# EAGLE design CANBed_case (EAGLE 6.4)
DESCRIPTION: microOBD 200 OBD-II Module; HW_REV: 1.4; PCB_REV: C; PCB_SPEC1: Layer Count: 4; PCB_SPEC2: Size: 1.3" x 0.59"; PCB_SPEC3: Finish Thickness: 0.049" - 0.052"; PCB_SPEC4: Copper Weight: 1oz; TITLE: STM1120

## Sheet 1 of 2
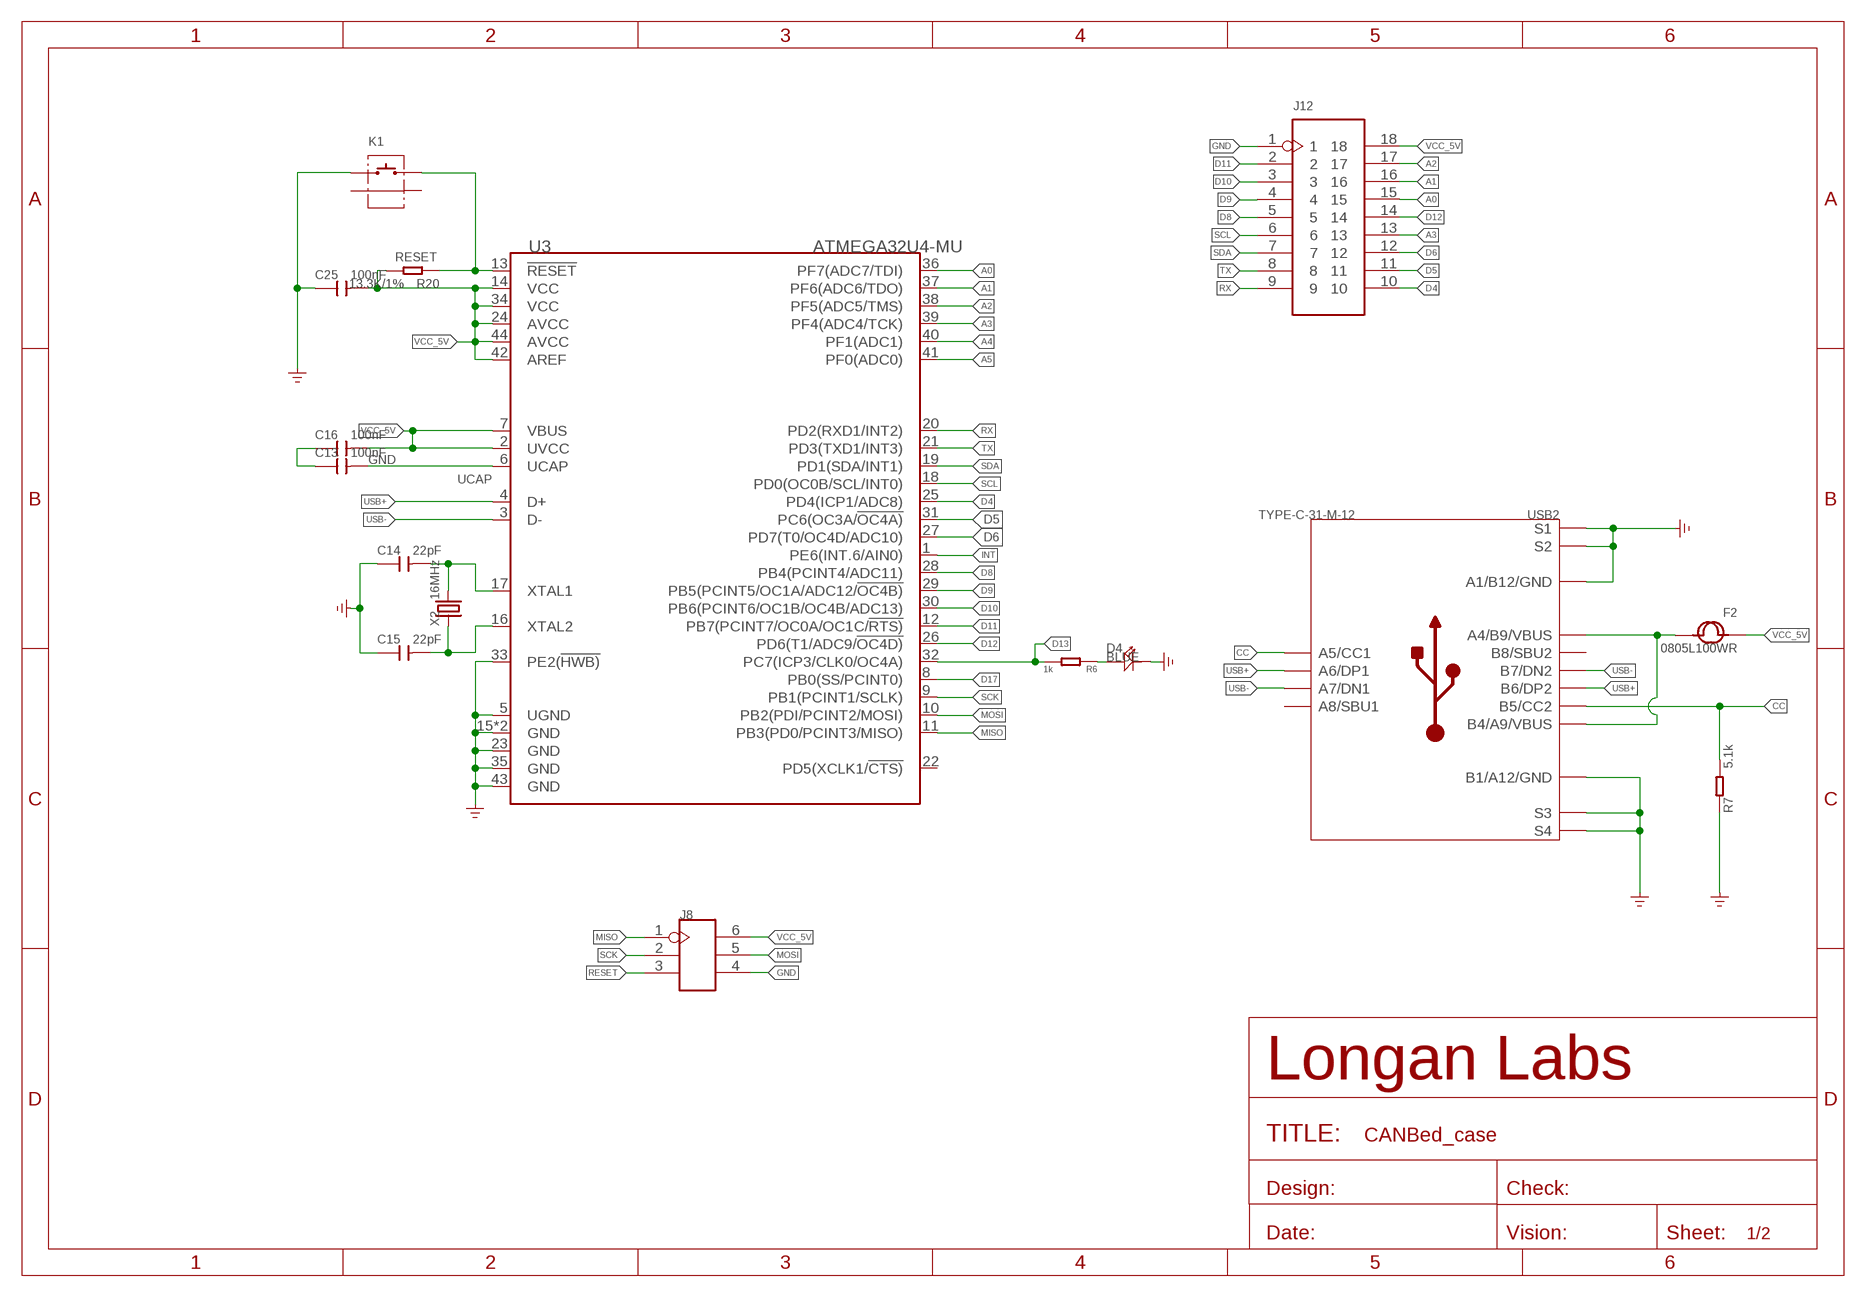
[diagram p0: schematic, sheet 1, part 1 of 2]
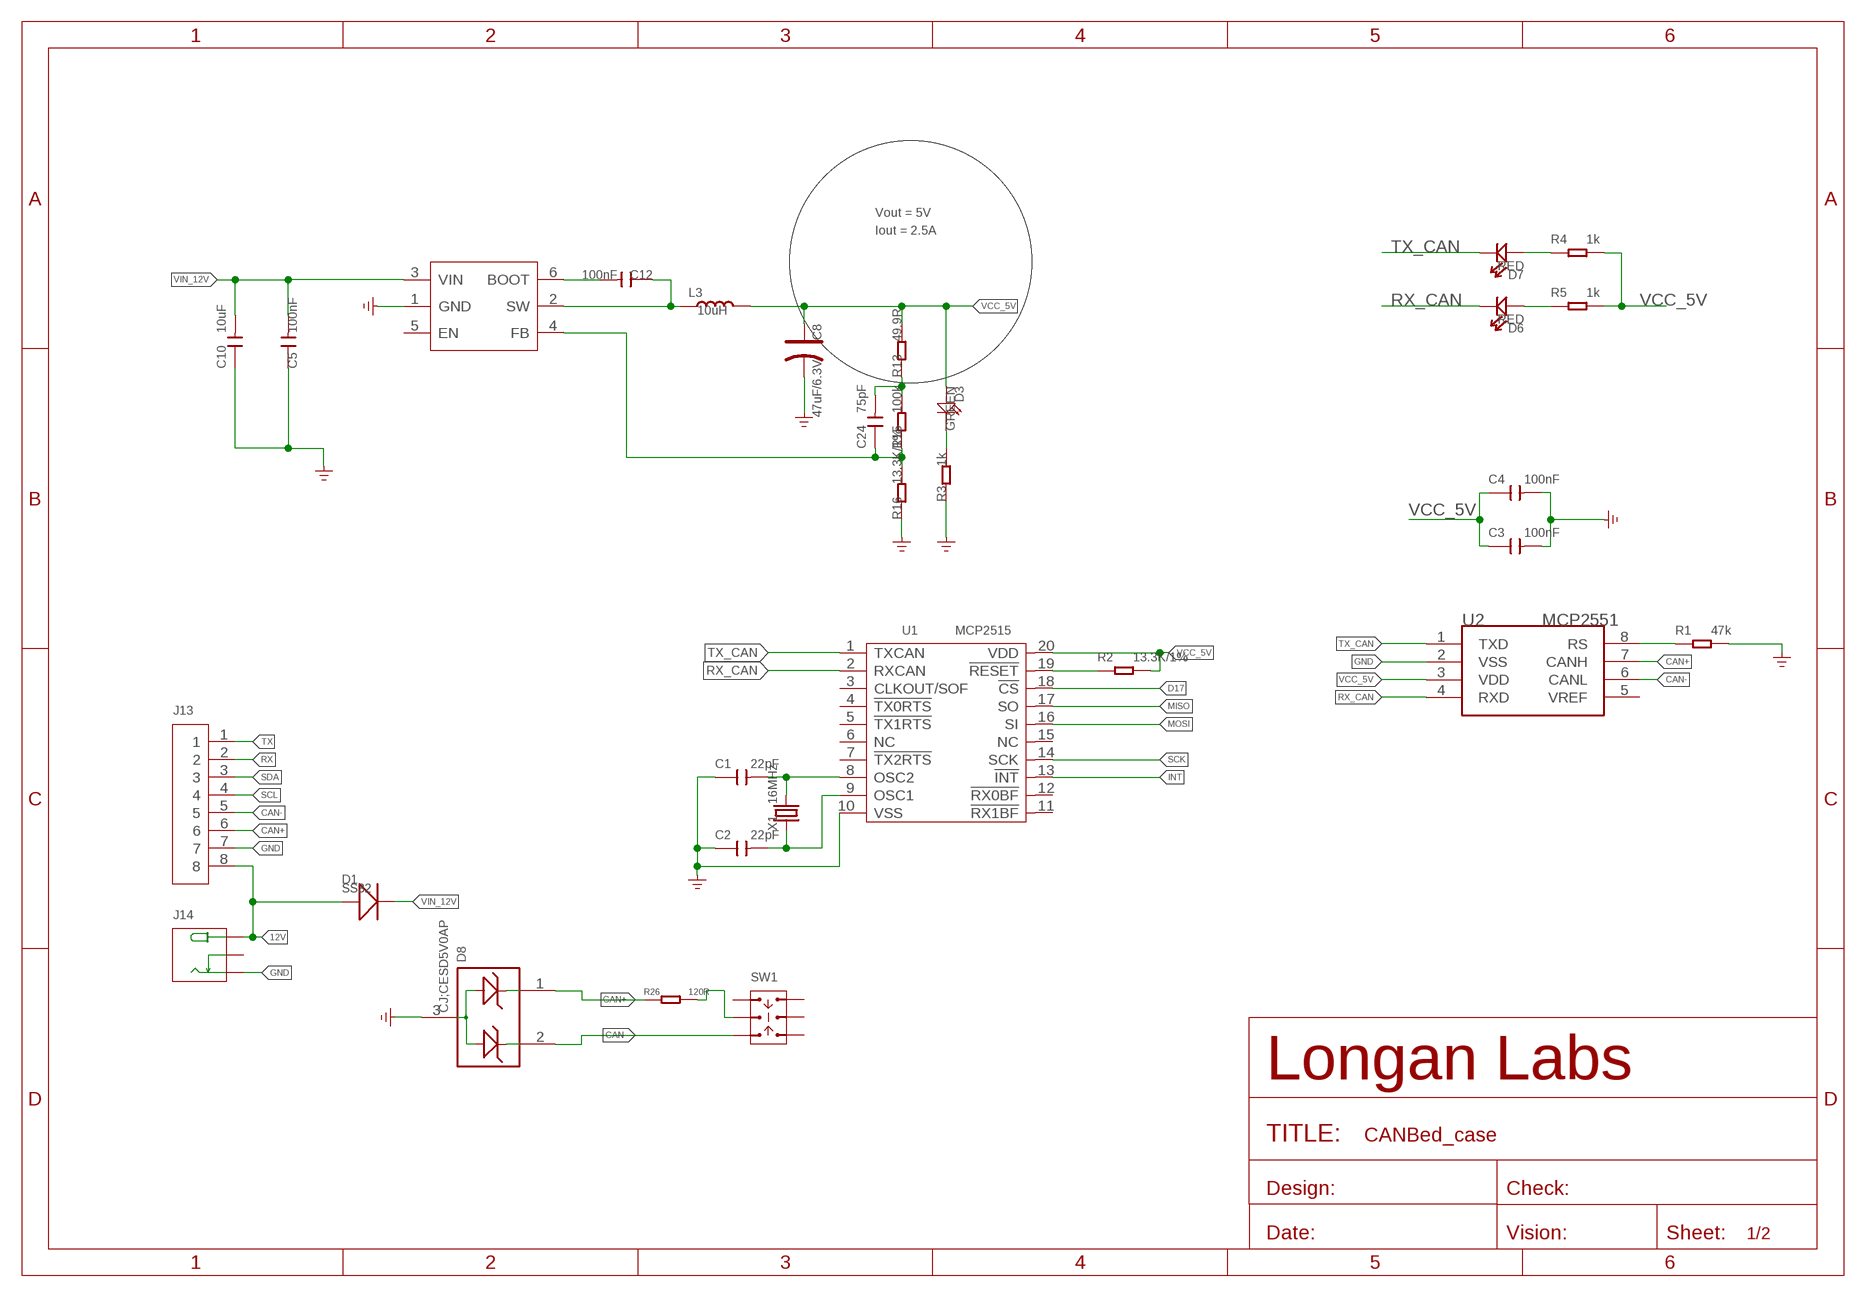
[diagram p1: schematic, sheet 1, part 2 of 2]

### Parts
C1  22pF  CAP-0603  [C0603]
C2  22pF  CAP-0603  [C0603]
C3  100nF  CAP-0603  [C0603]
C4  100nF  CAP-0603  [C0603]
C5  100nF  CAP-0603  [C0603]
C8  47uF/6.3V  CAP-POLAR-AVX-B  [AVX-B]
C10  10uF  CAP-1206  [C1206]
C12  100nF  CAP-0603  [C0603]
C13  100nF  CAP-0603  [C0603]
C14  22pF  CAP-0603  [C0603]
C15  22pF  CAP-0603  [C0603]
C16  100nF  CAP-0603  [C0603]
C24  75pF  CAP-0603  [C0603]
C25  100nF  CAP-0603  [C0603]
D1  SS32  DIODE'SMA'  [DO-214AC]
D3  GREEN  LED'0805'  [LED0805-SIDE]
D4  BLUE  LED'0805'  [LED0805-SIDE]
D6  RED  LED'0603'  [LED-0603]
D7  RED  LED'0603'  [LED-0603]
D8  CJ;CESD5V0AP  D-ESD-3P'CESD3V3AP'  [SOT-23]
F2  0805L100WR  FUSE0805  [F0805]
J8  HEADER-2X3P-2.54  [H2X3-2.54]
J12  HEADER-2X9P-2.54  [H2X9-2.54]
J13  TERMINAL-8P  [TERMINAL8P-5.0-41.2X12.2X7.8MM]
J14  POWER-JACK-DC-320120003  [DCJ3P-14.2X11.0X9.0MM]
K1  BUTTON-2+2P-K2-1102AQ  [SW4-4.5-7X6.8X6MM]
L3  10uH  INDUCTOR-6.6X7.1  [INT2-SMD-6.6X7.1X3MM]
R1  47k  RES-0603  [R0603]
R2  13.3K/1%  RES-0603  [R0603]
R3  1k  RES-0603  [R0603]
R4  1k  RES-0603  [R0603]
R5  1k  RES-0603  [R0603]
R6  1k  RES-0603  [R0603]
R7  5.1k  RES-0603  [R0603]
R13  49.9R  RES-0603  [R0603]
R15  100k  RES-0603  [R0603]
R16  13.3K/1%  RES-0603  [R0603]
R20  13.3K/1%  RES-0603  [R0603]
R26  120R  RES-0603  [R0603]
SW1  SWITCH-2CH-6P-311010004  [SW6-2.54-9.0X3.5X3.2+2.0MM]
U1  MCP2515  MCP2515'ST'  [TSSOP20-0.65-6.5X4.4MM]
U2  MCP2551  MCP2551-SOIC8  [SOIC8-6.0]
U3  ATMEGA32U4-MU  MCU-ATMEGA32U4-MUR  [QFN44G-0.5-7X7MM]
U6  PMIC-TPS54302  [SOT-23-6]
USB2  TYPE-C-31-M-12  USB2.0-TYPE-C  [USB2.0-TYPE-C]
X1  16MHz  CRYSTAL-2P-3225  [X4-SMD-3.2X2.5X0.7MM]
X2  16MHz  CRYSTAL-2P-3225  [X4-SMD-3.2X2.5X0.7MM]

### Nets
12V: D1.1(+) J13.8 J14.+
A0: J12.15 U3.36(PF7(ADC7/TDI))
A1: J12.16 U3.37(PF6(ADC6/TDO))
A2: J12.17 U3.38(PF5(ADC5/TMS))
A3: J12.13 U3.39(PF4(ADC4/TCK))
A4: U3.40(PF1(ADC1))
A5: U3.41(PF0(ADC0))
CAN+: D8.1 J13.6 R26.1 U2.7(CANH)
CAN-: D8.2 J13.5 SW1.CH1B U2.6(CANL)
CC: R7.2 USB2.A5(A5/CC1) USB2.B5(B5/CC2)
D4: J12.10 U3.25(PD4(ICP1/ADC8))
D5: J12.11 U3.31(PC6(OC3A/!OC4A))
D6: J12.12 U3.27(PD7(T0/OC4D/ADC10))
D8: J12.5 U3.28(PB4(PCINT4/ADC11))
D9: J12.4 U3.29(PB5(PCINT5/OC1A/ADC12/!OC4B))
D10: J12.3 U3.30(PB6(PCINT6/OC1B/OC4B/ADC13))
D11: J12.2 U3.12(PB7(PCINT7/OC0A/OC1C/!RTS))
D12: J12.14 U3.26(PD6(T1/ADC9/!OC4D))
D13: R6.2 U3.32(PC7(ICP3/CLK0/OC4A))
D17: U1.18(!CS) U3.8(PB0(SS/PCINT0))
GND: C1.1 C2.1 C3.2 C4.2 C5.1 C8.- C10.1 C13.1 C14.1 C15.1 C16.1 C25.1 D4.- D8.3 J8.4 J12.1 J13.7 J14.-1(-) K1.1 R1.2 R3.1 R7.1 R16.1 U1.10(VSS) U2.2(VSS) U3.5(UGND) U3.15(GND) U3.23(GND) U3.33(PE2(!HWB)) U3.35(GND) U3.43(GND) U3.TAB(GND) U6.1(GND) USB2.A1_B12(A1/B12/GND) USB2.B1_A12(B1/A12/GND) USB2.S1 USB2.S2 USB2.S3 USB2.S4 USB2.S5(S1) USB2.S6(S2) ; supply symbol labelled GND_POWER
INT: U1.13(!INT) U3.1(PE6(INT.6/AIN0))
MISO: J8.1 U1.17(SO) U3.11(PB3(PD0/PCINT3/MISO))
MOSI: J8.5 U1.16(SI) U3.10(PB2(PDI/PCINT2/MOSI))
N$1: D3.- R3.2
N$2: D7.+ R4.1
N$4: F2.2 USB2.A4_B9(A4/B9/VBUS) USB2.B4_A9(B4/A9/VBUS)
N$5: R26.2 SW1.COM1
N$6: C14.2 U3.17(XTAL1) X2.3
N$8: D4.+ R6.1
N$11: C12.1 L3.1 U6.2(SW)
N$12: C15.2 U3.16(XTAL2) X2.1
N$14: C12.2 U6.6(BOOT)
N$15: D6.+ R5.1
N$16: C1.2 U1.8(OSC2) X1.3
N$17: C2.2 U1.9(OSC1) X1.1
N$20: R1.1 U2.8(RS)
N$23: C24.2 R13.1 R15.2
N$26: C24.1 R15.1 R16.2 U6.4(FB)
RESET: J8.3 K1.2 R20.1 U3.13(!RESET)
RST_N: R2.1 U1.19(!RESET)
RX: J12.9 J13.2 U3.20(PD2(RXD1/INT2))
RX_CAN: D6.- U1.2(RXCAN) U2.4(RXD)
SCK: J8.2 U1.14(SCK) U3.9(PB1(PCINT1/SCLK))
SCL: J12.6 J13.4 U3.18(PD0(OC0B/SCL/INT0))
SDA: J12.7 J13.3 U3.19(PD1(SDA/INT1))
TX: J12.8 J13.1 U3.21(PD3(TXD1/INT3))
TX_CAN: D7.- U1.1(TXCAN) U2.1(TXD)
UCAP: C13.2 U3.6(UCAP)
USB+: U3.4(D+) USB2.A6(A6/DP1) USB2.B6(B6/DP2)
USB-: U3.3(D-) USB2.A7(A7/DN1) USB2.B7(B7/DN2)
VCC_5V: C3.1 C4.1 C8.+ C16.2 C25.2 D3.+ F2.1 J8.6 J12.18 L3.2 R2.2 R4.2 R5.2 R13.2 R20.2 U1.20(VDD) U2.3(VDD) U3.2(UVCC) U3.7(VBUS) U3.14(VCC) U3.24(AVCC) U3.34(VCC) U3.42(AREF) U3.44(AVCC)
VIN_12V: C5.2 C10.2 D1.2(-) U6.3(VIN)
Unconnected: J14.-2(CDN) K1.3(S1) K1.4(S2) SW1.CH1A SW1.CH2A SW1.CH2B SW1.COM2 U1.3(CLKOUT/SOF) U1.4(!TX0RTS) U1.5(!TX1RTS) U1.6(NC) U1.7(!TX2RTS) U1.11(!RX1BF) U1.12(!RX0BF) U1.15(NC) U2.5(VREF) U3.22(PD5(XCLK1/!CTS)) U6.5(EN) USB2.A8(A8/SBU1) USB2.B8(B8/SBU2)

### Notes on the sheet
- Vout = 5V
- Iout = 2.5A

## Sheet 2 of 2

## Library data of the parts
C1-C5 C10 C12-C16 C24 C25 = Discrete-new:CAP: Ceramic Capacitors
C8 = Discrete-new:CAP-POLAR: Electrolytic Capacitors,Tantalum Capacitors and Super Capacitors
D1 = Discrete-new:DIODE*
D3 D4 = fat cong:LED
D6 D7 = Discrete-new:LED
D8 = Discrete-new:D-ESD-3P: 304060003
F2 = Discrete-small:FUSE
J8 = Connector-new:HEADER-2X3P
J12 = Connector-new:HEADER-2X9P
J13 = Longan-Connect:TERMINAL-8P
J14 = Connector-new:POWER-JACK-DC
K1 = Switch:BUTTON-2+2P
L3 = Discrete-new:INDUCTOR
R1-R7 R13 R15 R16 R20 R26 = Discrete-new:RES
SW1 = Switch:SWITCH-2CH-6P
U1 = Heilight:MCP2515
U2 = IC:MCP2551: High-Speed CAN Transceiver http://ww1.microchip.com/downloads/en/devicedoc/21667f.pdf
U3 = IC-new:MCU-ATMEGA32U4: TQFP-44:310010010;VQFN-44:310010016
U6 = IC-new:PMIC-TPS54302
USB2 = Connector-new:USB2.0-TYPE-C
X1 X2 = Discrete-new:CRYSTAL-2P

## Board
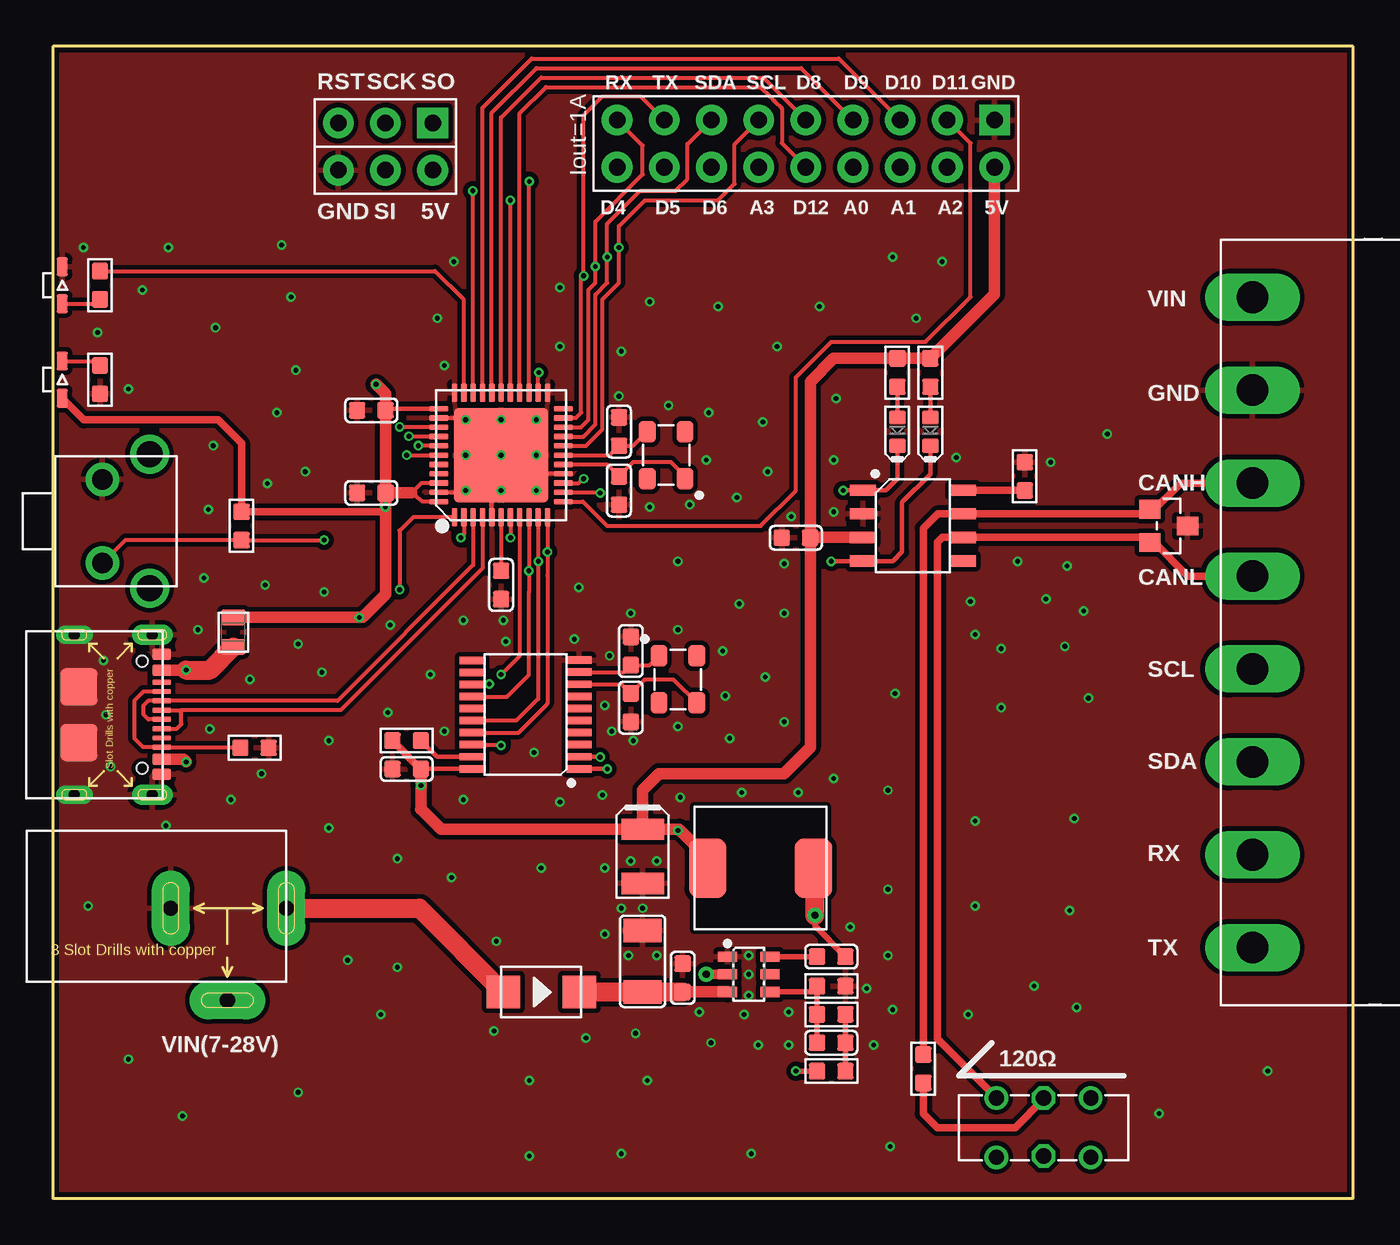
[diagram p2: board, top side]
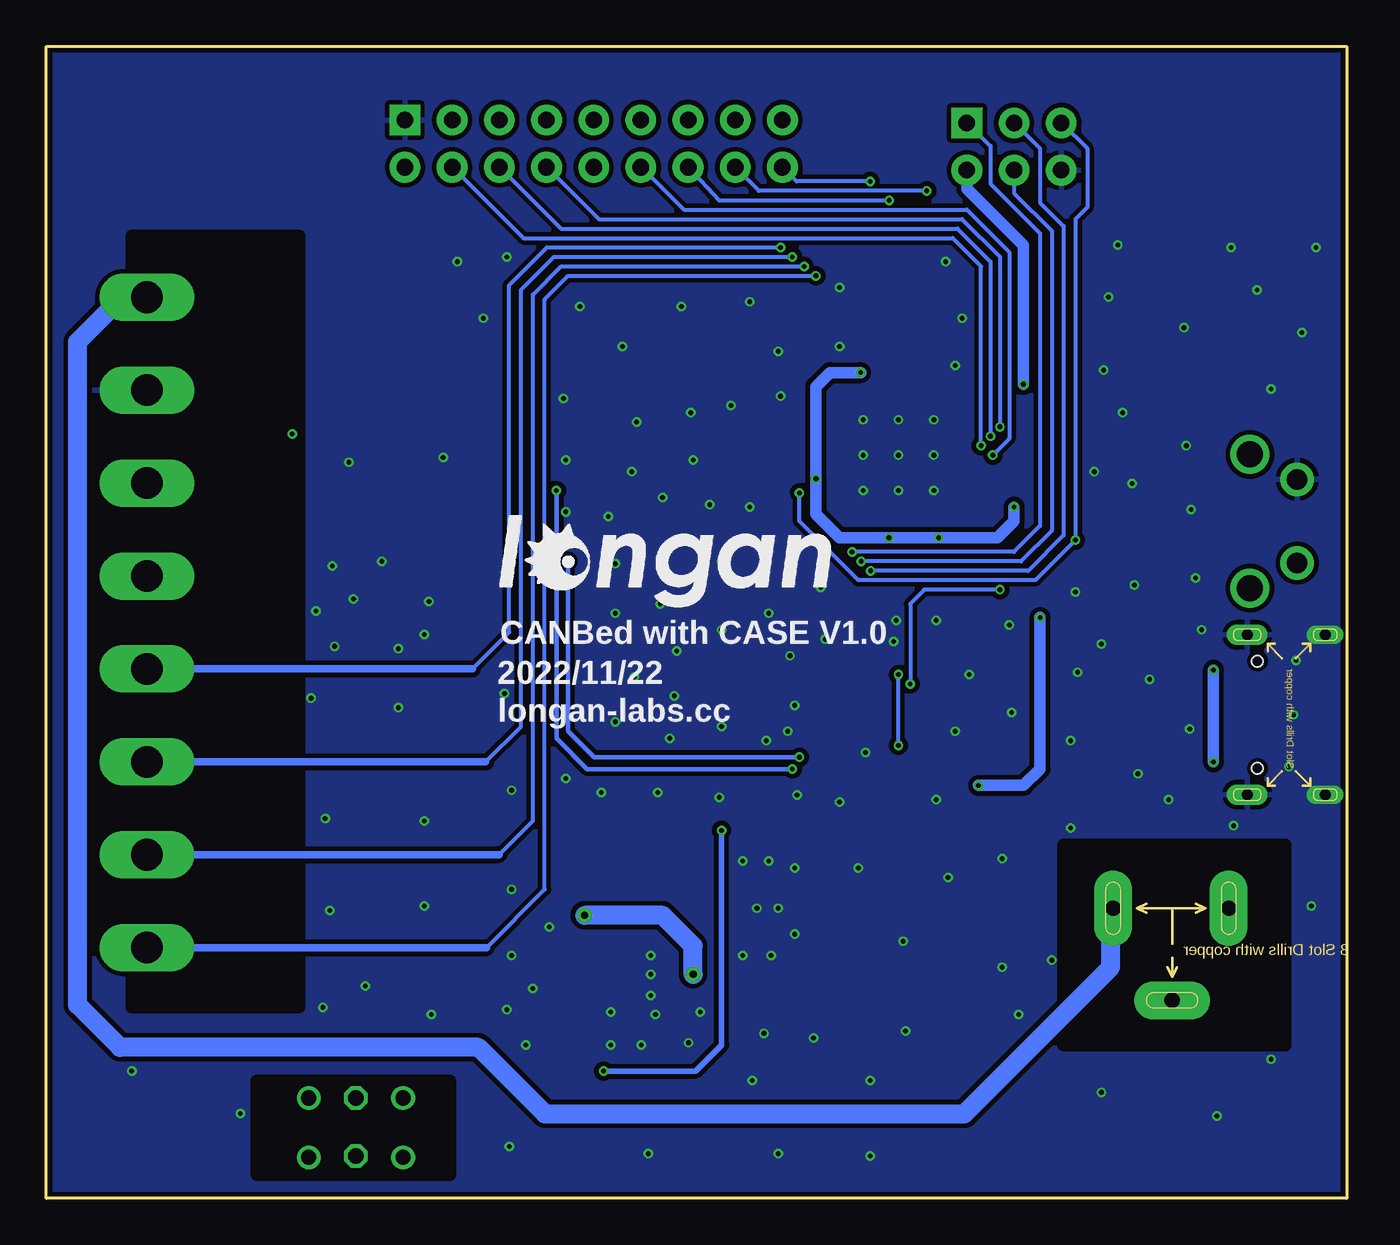
[diagram p3: board, bottom side, seen from below]

Size 70 x 62 mm. Coordinates in mm from the lower left corner, seen from the top.
Outline: 0,0 70,0 70,62 0,62 0,0
Copper layers (1*16): Top 0.035mm / dielectric 1.5mm / Bottom 0.035mm
Design rules "SeeedStudio_2layer_DRU_no_angle_20140221 *": minimum track width 1mil, minimum drill 10mil, track to track 5mil, track to pad 5mil, pad to pad 5mil, via to via 5mil, smd to smd 0mil, copper to edge 10mil, drill to drill 10mil, minimum pad ring 4mil, minimum via ring 4mil, stop-mask expansion 2mil, vias tented up to drill 25mil, thermal gap 10mil
tRestrict: area 34.5,14.5 to 41.7,21.1
bRestrict: area 56.4,10.3 to 65.4,51.8; area 3.3,8.3 to 15.2,19.1; area 48.3,1.3 to 58.7,6.3

### Footprints (pad centres in the part's own frame; a part is rotated, then mirrored left to right if it is on the bottom)
C0603 = smd 0.889 x 0.889: 1 -0.762,0; 2 0.762,0
AVX-B = smd 1.143 x 2.286: + 1.46,0; - -1.46,0
C1206 = smd 1.27 x 2.032: 1 -1.651,0; 2 1.651,0
DO-214AC = smd 1.8 x 1.77: 1 -2.042,0; 2 2.042,0
LED0805-SIDE = smd 1 x 0.6: + -1,0; - 1,0
LED-0603 = smd 0.762 x 0.889: + 0.762,0; - -0.762,0
SOT-23 = smd 1.016 x 1.143: 1 -0.889,-1.016; 2 0.889,-1.016; 3 0,1.016
F0805 = smd 0.819 x 1.27: 1 -0.79,0; 2 0.79,0
H2X3-2.54 = drill 0.889 pad 1.651 square: 1 -1.27,2.54 | drill 0.889 pad 1.651: 2 -1.27,0; 3 -1.27,-2.54; 4 1.27,-2.54; 5 1.27,0; 6 1.27,2.54
H2X9-2.54 = drill 0.889 pad 1.651 square: 1 -1.27,10.16 | drill 0.889 pad 1.651: 2 -1.27,7.62; 3 -1.27,5.08; 4 -1.27,2.54; 5 -1.27,0; 6 -1.27,-2.54; 7 -1.27,-5.08; 8 -1.27,-7.62; 9 -1.27,-10.16; 10 1.27,-10.16; 11 1.27,-7.62; 12 1.27,-5.08; 13 1.27,-2.54; 14 1.27,0; 15 1.27,2.54; 16 1.27,5.08; 17 1.27,7.62; 18 1.27,10.16
TERMINAL8P-5.0-41.2X12.2X7.8MM = drill 1.7 pad 2.4 long: 1 -17.5,0; 2 -12.5,0; 3 -7.5,0; 4 -2.5,0; 5 2.5,0; 6 7.5,0; 7 12.5,0; 8 17.5,0
DCJ3P-14.2X11.0X9.0MM = drill 0.813 pad 2.032 long: + 3.175,0; -1 -3.048,0; -2 0,-4.953
SW4-4.5-7X6.8X6MM = drill 1.1 pad 1.8: 1 -2.25,-1.27; 2 2.25,-1.27 | drill 1.4 pad 2.1: 3 3.599,1.27; 4 -3.599,1.27
INT2-SMD-6.6X7.1X3MM = smd 2 x 3.2: 1 -2.85,0; 2 2.85,0
R0603 = smd 0.889 x 0.889: 1 -0.762,0; 2 0.762,0
SW6-2.54-9.0X3.5X3.2+2.0MM = drill 0.813 pad 1.27: CH1A -2.54,-1.6; CH1B 2.54,-1.6; CH2A -2.54,1.6; CH2B 2.54,1.6 | drill 0.813 pad 1.27 octagon: COM1 0,-1.6; COM2 0,1.524
TSSOP20-0.65-6.5X4.4MM = smd 0.4 x 1.35: 1 -2.925,-2.875; 2 -2.275,-2.875; 3 -1.625,-2.875; 4 -0.975,-2.875; 5 -0.325,-2.875; 6 0.325,-2.875; 7 0.975,-2.875; 8 1.625,-2.875; 9 2.275,-2.875; 10 2.925,-2.875; 11 2.91,2.875; 12 2.26,2.875; 13 1.61,2.875; 14 0.96,2.875; 15 0.325,2.875; 16 -0.325,2.875; 17 -0.975,2.875; 18 -1.625,2.875; 19 -2.275,2.875; 20 -2.925,2.875
SOIC8-6.0 = smd 0.6 x 1.4: 1 -1.905,-2.7; 2 -0.635,-2.7; 3 0.635,-2.7; 4 1.905,-2.7; 5 1.905,2.7; 6 0.635,2.7; 7 -0.635,2.7; 8 -1.905,2.7
QFN44G-0.5-7X7MM = smd 1 x 0.3: 1 -3.35,2.5; 2 -3.35,2; 3 -3.35,1.5; 4 -3.35,1; 5 -3.35,0.5; 6 -3.35,0; 7 -3.35,-0.5; 8 -3.35,-1; 9 -3.35,-1.5; 10 -3.35,-2; 11 -3.35,-2.5; 23 3.35,-2.5; 24 3.35,-2; 25 3.35,-1.5; 26 3.35,-1; 27 3.35,-0.5; 28 3.35,0; 29 3.35,0.5; 30 3.35,1; 31 3.35,1.5; 32 3.35,2; 33 3.35,2.5 | smd 0.3 x 1: 12 -2.5,-3.35; 13 -2,-3.35; 14 -1.5,-3.35; 15 -1,-3.35; 16 -0.5,-3.35; 17 0,-3.35; 18 0.5,-3.35; 19 1,-3.35; 20 1.5,-3.35; 21 2,-3.35; 22 2.5,-3.35; 34 2.5,3.35; 35 2,3.35; 36 1.5,3.35; 37 1,3.35; 38 0.5,3.35; 39 0,3.35; 40 -0.5,3.35; 41 -1,3.35; 42 -1.5,3.35; 43 -2,3.35; 44 -2.5,3.35 | smd 5.08 x 5.08: TAB 0,0
SOT-23-6 = smd 0.55 x 1.016: 1 -0.95,-1.143; 2 0,-1.143; 3 0.95,-1.143; 4 0.95,1.143; 5 0,1.143; 6 -0.95,1.143
USB2.0-TYPE-C = smd 1 x 0.6: A1_B12 -0.05,3.25; A4_B9 -0.05,2.4; B1_A12 -0.05,-3.2; B4_A9 -0.05,-2.4 | smd 1 x 0.3: A5 -0.05,1.25; A6 -0.05,0.25; A7 -0.05,-0.25; A8 -0.05,-1.25; B5 -0.05,-1.75; B6 -0.05,-0.75; B7 -0.05,0.75; B8 -0.05,1.75 | drill 0.6 pad 1 long: S1 -4.75,4.3; S2 -4.75,-4.3 | drill 0.6 pad 1.1 long: S3 -0.55,4.3; S4 -0.55,-4.3 | smd 2 x 2: S5 -4.5,1.5; S6 -4.5,-1.5 | hole 0.6: -1.1,-2.89; -1.1,2.89
X4-SMD-3.2X2.5X0.7MM = smd 1.143 x 0.889: 1 -1.27,-1.016; 2 1.27,-1.016; 3 1.27,1.016; 4 -1.27,1.016

### Placement (x,y rotation side)
C1  31.11,26.42 90 top
C2  31.11,29.46 270 top
C3  40.01,35.56 180 top
C4  19.05,23.11 180 top
C5  33.91,11.87 270 top
C8  31.75,18.41 90 top
C10  31.75,12.76 270 top
C12  41.91,13.02 180 top
C13  24.13,33.02 90 top
C14  30.48,41.27 270 top
C15  30.48,38.1 90 top
C16  17.14,42.42 0 top
C24  41.91,8.38 0 top
C25  17.14,37.97 0 top
D1  26.29,11.11 0 top
D3  0.51,44.07 90 top
D4  0.51,49.15 90 top
D6  47.24,41.27 90 top
D7  45.47,41.27 90 top
D8  60.07,36.2 270 top
F2  9.72,30.48 270 top
J8  17.91,56.61 270 top
J12  40.54,56.77 270 top
J13  64.58,31 90 top
J14  9.4,15.62 0 top
K1  3.94,36.45 270 top
L3  38.1,17.78 180 top
R1  52.32,38.86 90 top
R2  19.05,24.64 180 top
R3  2.54,44.07 90 top
R4  45.47,44.45 90 top
R5  47.24,44.45 90 top
R6  2.54,49.15 90 top
R7  10.86,24.26 180 top
R13  41.91,6.86 180 top
R15  41.91,9.91 0 top
R16  41.91,11.43 180 top
R20  10.16,36.2 90 top
R26  46.86,6.99 270 top
SW1  53.34,3.81 180 top
U1  25.45,26.05 90 top
U2  46.31,36.21 270 top
U3  24.13,40.01 90 top
U6  37.47,12.06 270 top
U$5  [LONGAN-SILK-SMALL]  47.24,30.35 0 bottom
USB2  5.91,26.04 0 top
X1  33.66,27.94 270 top
X2  33.02,40.01 90 top

### Tracks (layer width: path | path; a pad name or v marks a point on that pad's centre or on a via)
12V
  Top 1.016: J14.+ 19.74,15.62 D1.1
  Bottom 1.016: J14.+ 12.7,15.49 12.7,12.45 20.59,4.56 43.17,4.56 46.74,8.13 66.04,8.13 68.33,10.41 68.33,46.1 65.91,48.51 64.59,48.51 J13.8
A0  (via drill 0.25 pad 0.51)
  Top 0.203: v18.67,41.53 20.76,41.53 U3.36
  Bottom 0.203: J12.15 43.05,55.5 40.26,52.7 20.7,52.7 18.67,50.67 v18.67,41.53
A1  (via drill 0.25 pad 0.51)
  Top 0.203: v19.18,41.02 20.76,41.02 U3.37
  Bottom 0.203: J12.16 45.59,55.5 42.29,52.2 20.95,52.2 19.18,50.42 v19.18,41.02
A2  (via drill 0.25 pad 0.51)
  Top 0.203: U3.38 19.69,40.51 v19.68,40.51
  Bottom 0.203: J12.17 48.13,55.5 44.32,51.69 21.21,51.69 19.68,50.16 v19.68,40.51
A3  (via drill 0.25 pad 0.51)
  Top 0.203: v19.05,40.01 U3.39
  Bottom 0.203: J12.13 37.97,55.5 35.69,53.21 20.45,53.21 18.16,50.93 18.16,40.89 v19.05,40.01
CAN+
  Top 0.406: 59.07,36.85 U2.7 47.64,36.85 46.86,36.07 R26.1 | 59.07,36.85 60.73,38.5 J13.6 | 59.07,36.85 59.07,37.07 D8.1
CAN-
  Top 0.406: SW1.CH1B 47.62,8.59 47.62,35.31 47.9,35.58 U2.6 59.04,35.58 59.24,35.37 | J13.5 61.11,33.5 59.24,35.37 | D8.2 59.18,35.31 59.24,35.37
CC
  Top 0.203: R7.2 9.69,24.29 USB2.B5 4.86,24.29 4.38,24.77 4.38,26.8 4.87,27.29 USB2.A5
D4  (via drill 0.25 pad 0.51)
  Top 0.203: U3.25 25.63,54.71 v25.65,54.74
  Bottom 0.203: v25.65,54.74 29.62,54.74 J12.10
D5  (via drill 0.25 pad 0.51)
  Top 0.203: U3.31 22.63,54.2 v22.61,54.23
  Bottom 0.203: v22.61,54.23 31.65,54.23 J12.11
D6  (via drill 0.25 pad 0.51)
  Top 0.203: U3.27 v24.63,53.72
  Bottom 0.203: J12.12 35.43,55.5 33.78,53.72 v24.63,53.72
D8
  Top 0.203: U3.28 24.13,58.17 26.29,60.33 38.25,60.33 J12.5
D9
  Top 0.203: U3.29 23.63,58.43 26.04,60.83 40.28,60.83 J12.4
D10
  Top 0.203: U3.30 23.13,58.69 25.78,61.34 42.32,61.34 J12.3
D11
  Top 0.203: U3.12 28.54,37.51 29.84,36.2 38.1,36.2 40.01,38.1 40.01,44.2 41.91,46.1 46.99,46.1 49.4,48.51 49.4,56.8 J12.2
D12
  Top 0.203: U3.26 25.13,58.4 26.54,59.82 38.1,59.82 38.61,59.31 38.86,59.05 39.24,58.67 39.24,56.8 J12.14
D13
  Top 0.203: U3.32 22.13,48.35 20.57,49.91 R6.2
D17  (via drill 0.25 pad 0.51)
  Top 0.203: U3.8 25.13,29.19 v24.13,28.19 | U1.18 24.09,24.42 v24.13,24.38
  Bottom 0.203: v24.13,24.38 v24.13,28.19
GND  (via drill 0.25 pad 0.51)
  Top 0.203: U3.35 22.07,42.01 | 22.07,42.01 22.1,42.04 | U3.5 23.63,38.35 23.62,38.35 23.88,38.35 v24.13,38.1 | U3.15 25.67,39.01 25.65,38.99 25.65,38.48 v26.04,38.1 | U3.43 22.13,38.01 v22.23,38.1 | 22.07,42.01 22.13,42.01 v22.23,41.91
  other vias: 31.75,15.62 29.72,17.78 31.11,18.16 32.51,18.16 30.61,15.62 29.72,14.22 30.99,13.08 32.51,13.08 37.47,13.08 37.47,12.06 37.47,10.92 34.8,10.03 37.21,9.91 39.62,10.03 39.62,8.26 35.43,8.38 37.97,8.26 43.81,11.3 42.93,14.61 44.96,13.08 45.21,10.16 44.2,8.26 23.75,9.02 28.7,8.64 31.37,8.89 32,6.35 25.65,6.35 25.65,2.29 30.61,2.41 37.59,2.41 45.09,2.79 49.28,9.91 52.83,11.43 55.12,10.29 59.56,4.57 65.41,6.86 42.04,36.96 39.75,36.7 42.04,39.75 42.16,43.05 48.64,39.88 53.72,39.62 56.77,41.15 51.94,34.29 54.61,34.04 49.4,32.13 49.66,30.35 53.47,32.26 55.5,31.62 51.05,29.59 54.48,29.72 39.37,34.16 39.37,31.5 39.37,25.65 29.72,26.54 31.24,24.64 30.1,25.15 33.66,25.4 36.45,24.77 36.2,27.05 36.07,29.46 33.66,30.61 38.35,28.07 36.96,32 31.11,31.5 29.97,29.21 28.07,30.1 24.26,31.11 24.38,29.97 28.32,32.89 32.13,37.21 34.29,37.34 36.83,37.72 38.48,39.12 35.18,39.75 35.31,42.29 33.15,42.67 30.48,43.18 30.61,45.59 32.13,48.26 35.81,48.01 41.27,48.01 38.99,45.85 38.23,41.78 46.48,47.37 47.88,50.42 45.21,50.67 27.3,45.85 27.3,49.02 20.7,47.37 21.08,44.83 24.13,41.91 26.04,41.91 26.04,40.01 22.23,40.01 24.13,40.01 12.83,48.51 13.08,44.58 13.59,39.12 8.13,33.4 11.43,33.02 14.61,32.64 7.81,30.61 8.38,37.08 8.64,40.51 11.56,38.48 4.06,43.56 2.41,46.61 4.83,48.9 1.65,51.18 6.22,51.18 12.32,51.31 21.59,50.42 8.76,46.86 12.06,42.29 2.73,28.96 2.86,26.04 3.11,23.24 9.59,21.46 11.24,22.86 8.45,25.27 14.86,24.64 18.54,18.29 18.03,26.16 21.08,25.15 22.1,31.11 20.32,28.19 25.91,24 22.1,21.46 27.3,21.34 29.59,21.72 33.78,21.59 37.08,21.84 40.13,21.84 42.04,22.61 23.88,13.84 26.29,17.78 21.46,17.27 14.86,19.94 15.88,12.83 18.54,12.45 17.65,9.91 13.21,5.71 6.99,4.45 4.06,7.49 1.91,15.75 6.1,20.07 10.6,27.94 13.21,29.84 14.48,28.32 18.16,30.86 51.05,26.42 55.75,26.92 49.66,20.32 54.99,20.45 54.74,15.49 49.66,15.75 44.96,16.64 44.96,21.97 45.34,27.18 33.66,34.29
  pour Top (isolate 0.254, rank 6): -6.22,62.74 71.12,62.87 71.5,-0.64 -5.84,-0.76
  pour Bottom (isolate 0.254, rank 6): -7.62,62.61 71.12,62.61 71.5,-0.64 -7.24,-0.64
INT  (via drill 0.25 pad 0.51)
  Top 0.203: U3.1 19.38,36.66 18.67,35.94 v18.67,32.77 | v23.5,27.69 22.6,27.69 U1.13
  Bottom 0.203: v18.67,32.77 22.73,32.77 23.5,32 v23.5,27.69
MISO  (via drill 0.25 pad 0.51)
  Top 0.203: U1.17 25.07,25.07 26.63,26.63 26.63,33.53 v26.63,34.8 U3.11
  Bottom 0.203: J8.1 20.41,57.88 19.18,56.64 19.18,54.61 16.51,51.94 16.51,36.2 17.91,34.8 v26.63,34.8
MOSI  (via drill 0.25 pad 0.51)
  Top 0.203: U3.10 v26.13,34.29 26.13,33.66 26.13,26.89 24.96,25.72 U1.16
  Bottom 0.203: J8.5 17.91,54.1 15.88,52.07 15.88,35.94 17.53,34.29 v26.13,34.29
N$1
  Top 0.203: D3.- 2.3,45.07 R3.2
N$2
  Top 0.254: D7.+ R4.1
N$4  (via drill 0.25 pad 0.51)
  Top 0.61: USB2.A4_B9 v7.18,28.43 | USB2.B4_A9 7.04,23.64 v7.18,23.5
  Top 1.016: v7.18,28.43 8.46,28.43 F2.2
  Bottom 0.61: v7.18,23.5 v7.18,28.43
N$5
  Top 0.406: SW1.COM1 53.34,5.33 51.82,3.81 47.62,3.81 46.86,4.57 R26.2
N$6
  Top 0.203: U3.17 29.97,40.01 C14.2 31.24,40.51 X2.3
N$8
  Top 0.203: D4.+ 2.3,48.15 R6.1
N$11  (via drill 0.38 pad 0.81)
  Top 0.305: 41.15,17.02 41.15,17.58 L3.1 | v41.02,15.24 41.02,14.67 C12.1
  Top 0.508: U6.2 v35.18,12.06
  Top 1.016: v41.02,15.24 41.02,17.71 L3.1
  Bottom 1.016: v35.18,12.06 35.18,13.59 36.83,15.24 v41.02,15.24
N$12
  Top 0.203: U3.16 29.84,39.51 C15.2 31.24,39.62 33.27,39.62 34.04,38.86 X2.1
N$14
  Top 0.305: U6.6 C12.2
N$15
  Top 0.254: D6.+ R5.1
N$16
  Top 0.203: U1.8 30.62,27.67 C1.2 31.88,27.94 33.4,27.94 X1.3
N$17
  Top 0.203: U1.9 30.74,28.32 C2.2 32.13,28.7 X1.1
N$20
  Top 0.406: U2.8 51.93,38.12 R1.1
N$23
  Top 0.305: R13.1 C24.2 R15.2
N$26
  Top 0.305: U6.4 40.83,11.12 R16.2 R15.1 C24.1
RESET  (via drill 0.25 pad 0.51)
  Top 0.203: v14.61,35.43 R20.1 3.9,35.43 K1.2 | U3.13 29.43,38.01 v29.46,37.97
  Bottom 0.203: v29.46,37.97 29.46,36.45 26.29,33.27 16.76,33.27 v14.61,35.43 14.61,52.7 13.97,53.34 13.97,56.52 15.33,57.88 J8.3
RST_N
  Top 0.254: U1.19 20.68,23.77 R2.1
RX  (via drill 0.25 pad 0.51)
  Top 0.203: U3.20 28.42,41.51 28.83,41.91 28.83,48.9 29.21,49.28 v29.21,50.16 29.21,52.58 31.75,55.12 31.75,56.67 J12.9
  Bottom 0.203: 45.63,18.5 43.81,20.32 43.81,48.64 42.29,50.16 v29.21,50.16
  Bottom 0.406: J13.2 45.63,18.5
RX_CAN  (via drill 0.25 pad 0.51)
  Top 0.254: D6.- 47.24,38.99 45.72,37.47 45.72,34.8 45.23,34.31 U2.4 43.59,34.29 v41.91,34.29 | U1.2 29.44,23.77 v29.46,23.75
  Bottom 0.254: v29.46,23.75 40.51,23.75 41.91,25.15 v41.91,34.29
SCK  (via drill 0.25 pad 0.51)
  Top 0.203: U3.9 v25.63,33.78 25.63,32.64 25.63,28.19 24.45,27.01 U1.14
  Bottom 0.203: J8.2 17.87,57.88 16.51,56.52 16.51,53.59 15.24,52.32 15.24,35.69 17.14,33.78 v25.63,33.78
SCL  (via drill 0.25 pad 0.51)
  Top 0.203: U3.18 28.69,40.51 29.59,41.4 29.59,48.39 30.48,49.28 v30.48,51.18 30.48,52.32 31.88,53.72 35.81,53.72 36.7,54.61 36.7,56.74 J12.6
  Bottom 0.203: 47.06,28.5 45.09,30.48 45.09,49.15 43.05,51.18 v30.48,51.18
  Bottom 0.406: J13.4 47.06,28.5
SDA  (via drill 0.25 pad 0.51)
  Top 0.203: U3.19 28.56,41.01 29.21,41.66 29.21,48.64 29.84,49.28 v29.84,50.67 29.84,52.45 31.62,54.23 33.53,54.23 34.16,54.86 34.16,56.74 J12.7
  Bottom 0.203: 46.35,23.5 44.45,25.4 44.45,48.9 42.67,50.67 v29.84,50.67
  Bottom 0.406: J13.3 46.35,23.5
TX  (via drill 0.25 pad 0.51)
  Top 0.203: U3.21 28.16,42.01 28.45,42.29 28.45,49.53 v28.57,49.66 28.57,58.29 29.59,59.31 31.65,59.31 J12.8
  Bottom 0.203: 46.32,13.5 43.18,16.64 43.18,48.39 41.91,49.66 v28.57,49.66
  Bottom 0.406: J13.1 46.32,13.5
TX_CAN  (via drill 0.25 pad 0.51)
  Top 0.254: D7.- 45.47,38.73 44.85,38.12 U2.1 42.56,38.12 v42.55,38.1 | U1.1 29.83,23.12 v29.84,23.11
  Bottom 0.254: v42.55,38.1 42.55,24.77 40.89,23.11 v29.84,23.11
UCAP
  Top 0.203: U3.6 C13.2
USB+
  Top 0.203: USB2.A6 6.92,26.29 | U3.4 23.13,33.92 15.5,26.29 6.92,26.29 | USB2.B6 6.68,25.29 6.92,25.53 6.92,26.29
USB-
  Top 0.203: U3.3 22.63,34.09 15.32,26.79 USB2.B7 5.13,26.79 4.89,26.54 4.89,26.04 5.14,25.79 USB2.A7
VCC_5V  (via drill 0.25 pad 0.51)
  Top 0.203: U3.2 22.13,35.72 v21.97,35.56 | U3.7 v24.63,35.57 v24.64,35.56 | U3.42 19.84,38.51 19.3,37.97 19.9,37.51 U3.44 | U3.14 28.3,38.51 v28.57,38.73 | U3.24 26.13,44.42 v26.16,44.45 | v33.66,19.81 33.72,19.88
  Top 0.254: U1.20 19.82,23.12 C4.1 | U3.34 17.99,42.51 C16.2 | 17.93,38.51 C25.2
  Top 0.305: R13.2 v40.01,6.86
  Top 0.406: D3.+ 1.67,41.91 8.89,41.91 10.16,40.64 R20.2 17.65,36.96 v17.91,37.21 | C4.1 R2.2
  Top 0.61: C25.2 C16.2 17.91,43.31 v17.4,43.81 | C25.2 v17.91,37.21 | C25.2 19.3,37.97 | J12.18 50.7,48.67 R5.2 R4.2 42.04,45.21 40.78,43.96 40.78,35.58 | U2.3 40.78,35.58 | 40.78,35.58 C3.1 | C8.+ 33.72,19.88 34.8,18.8 34.8,18.23 L3.2 | C8.+ 20.89,19.88 19.82,20.95 | 19.82,20.95 19.81,20.95 | 19.82,23.12 v19.82,22.23 19.82,20.95 | 40.78,35.58 40.78,24.27 39.37,22.86 32.64,22.86 31.75,21.97 C8.+ | F2.1 v16.51,31.27 16.67,31.27 17.91,32.51 C25.2
  Bottom 0.305: v40.01,6.86 35.05,6.86 33.66,8.26 v33.66,19.81
  Bottom 0.61: v21.97,35.56 v24.64,35.56 | v17.91,37.21 17.91,36.45 18.8,35.56 v21.97,35.56 | v21.97,35.56 27.3,35.56 28.57,36.83 v28.57,38.73 28.57,43.69 27.81,44.45 v26.16,44.45 | v19.82,22.23 17.39,22.23 16.51,23.11 v16.51,31.27 | v17.4,43.81 17.4,51.31 20.45,54.35 J8.6
VIN_12V
  Top 0.61: U6.3 33.4,11.12 33.4,11.11
  Top 1.016: C5.2 33.4,11.11 C10.2 D1.2

### Text on the board
tPlace: RST | SCK | SO | RX | TX | SDA | SCL | D8 | D9 | D10 | D11 | GND | Iout=1A | D5 | D6 | A3 | D12 | GND | SI | 5V | D4 | A0 | A1 | A2 | 5V | VIN | GND | CANH | CANL | SCL | SDA | RX | TX | VIN(7-28V) | 120Ω
bPlace: CANBed with CASE V1.0 | 2022/11/22 | longan-labs.cc